# Altium schematic sheet main.SchDoc
size 431 x 279 mm; SheetNumber: 2; SheetTotal: 7
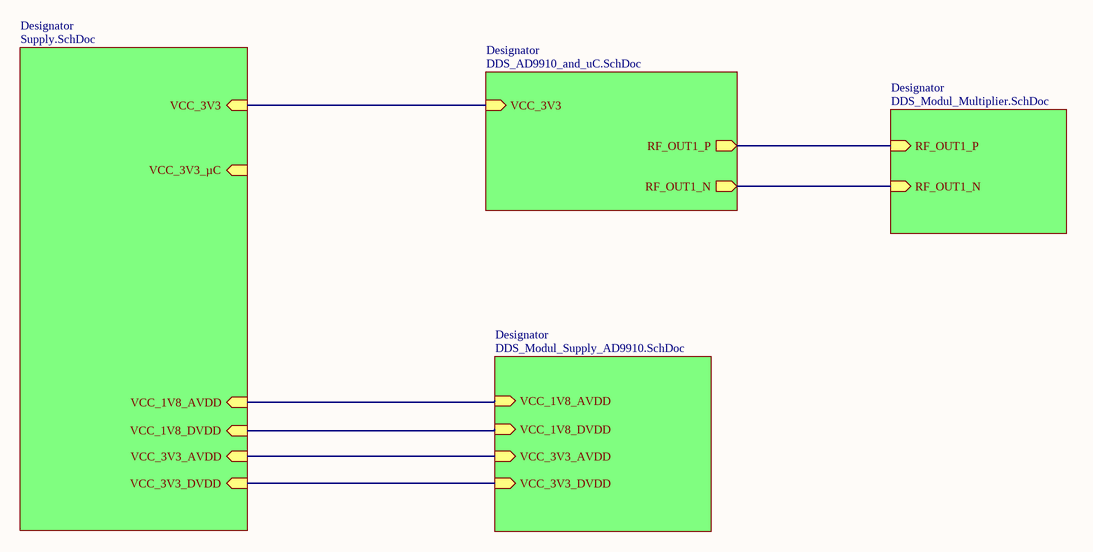
[diagram p0: main.SchDoc]

## Sub-sheets
Designator = DDS_Modul_Supply_AD9910.SchDoc: VCC_1V8_AVDD (in), VCC_3V3_AVDD (in), VCC_1V8_DVDD (in), VCC_3V3_DVDD (in)
Designator = DDS_Modul_Multiplier.SchDoc: RF_OUT1_P (in), RF_OUT1_N (in)
Designator = Supply.SchDoc: VCC_3V3_AVDD (in), VCC_3V3_DVDD (in), VCC_1V8_AVDD (in), VCC_1V8_DVDD (in), VCC_3V3_µC (in), VCC_3V3 (in)
Designator = DDS_AD9910_and_uC.SchDoc: RF_OUT1_P (out), RF_OUT1_N (out), VCC_3V3 (in)

## Nets
(unnamed): sheet Designator/VCC_1V8_AVDD, sheet Designator/VCC_1V8_AVDD
(unnamed): sheet Designator/VCC_3V3_AVDD, sheet Designator/VCC_3V3_AVDD
(unnamed): sheet Designator/VCC_1V8_DVDD, sheet Designator/VCC_1V8_DVDD
(unnamed): sheet Designator/VCC_3V3_DVDD, sheet Designator/VCC_3V3_DVDD
(unnamed): sheet Designator/RF_OUT1_P, sheet Designator/RF_OUT1_P
(unnamed): sheet Designator/RF_OUT1_N, sheet Designator/RF_OUT1_N
(unnamed): sheet Designator/VCC_3V3, sheet Designator/VCC_3V3

## Notes on the sheet
- DWG. NO.
- REV.
- SHT.
- THIS DOCUMENT AND THE DATA DISCLOSED HEREIN OR HEREWITH IS THE PROPERTY OF ALTIUM LIMITED AND MAY BE FREELY DISTRIBUTED IN WHOLE. NO RIGHTS ARE RESERVED OR EXPRESS OR IMPLIED WARANTEE GIVEN.
- REVISION
- DESCRIPTION
- DATE
- APPROVED
- ENG:
- APPROVALS
- PROJECT
- DSN:
- CHK:
- REFERENCE DOCUMENTS
- PROJECT REVISION:
- TITLE
- DOCUMENT REVISION:
- DESIGN ITEM:
- BOM:
- FAB DWG:
- PCB DWG:
- ASSY DWG:
- SCALE:
- SIZE
- B
- CAGE CODE
- FILE NAME
- DWG NO.
- SHEET
- OF
- REV